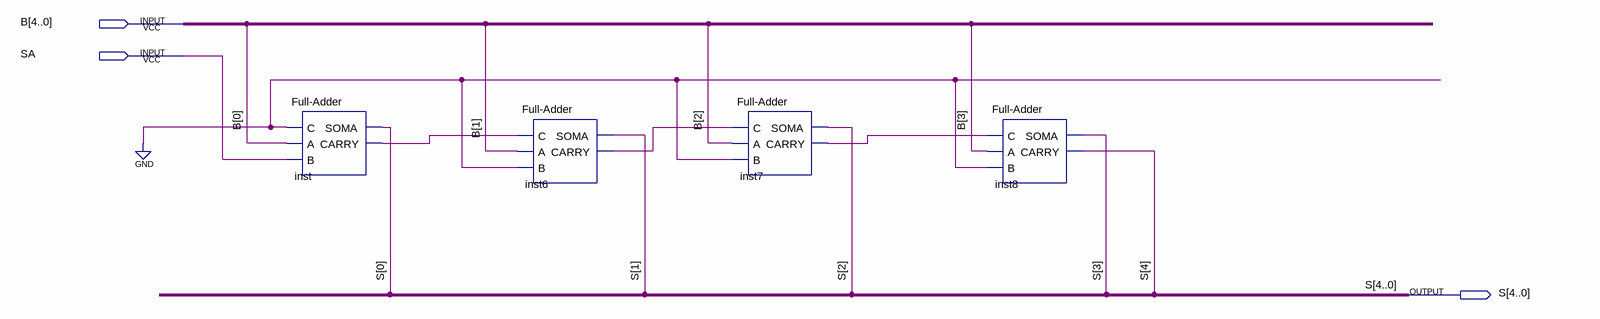
[diagram p0: schematic sheet]
// Quartus schematic SomaUmOK.bdf as structural Verilog: 4 symbols, 3 pins
module SomaUmOK (
  input  [4:0] B,
  input  SA,
  output [4:0] S
);

  wire inst6_carry, inst7_carry, inst_carry;

  \Full-Adder  inst (.C(1'b0), .A(B[0]), .B(SA), .SOMA(S[0]), .CARRY(inst_carry));
  \Full-Adder  inst6 (.C(inst_carry), .A(B[1]), .B(1'b0), .SOMA(S[1]), .CARRY(inst6_carry));
  \Full-Adder  inst7 (.C(inst6_carry), .A(B[2]), .B(1'b0), .SOMA(S[2]), .CARRY(inst7_carry));
  \Full-Adder  inst8 (.C(inst7_carry), .A(B[3]), .B(1'b0), .SOMA(S[3]), .CARRY(S[4]));
endmodule
